# Altium project Lights Board.PrjPcb
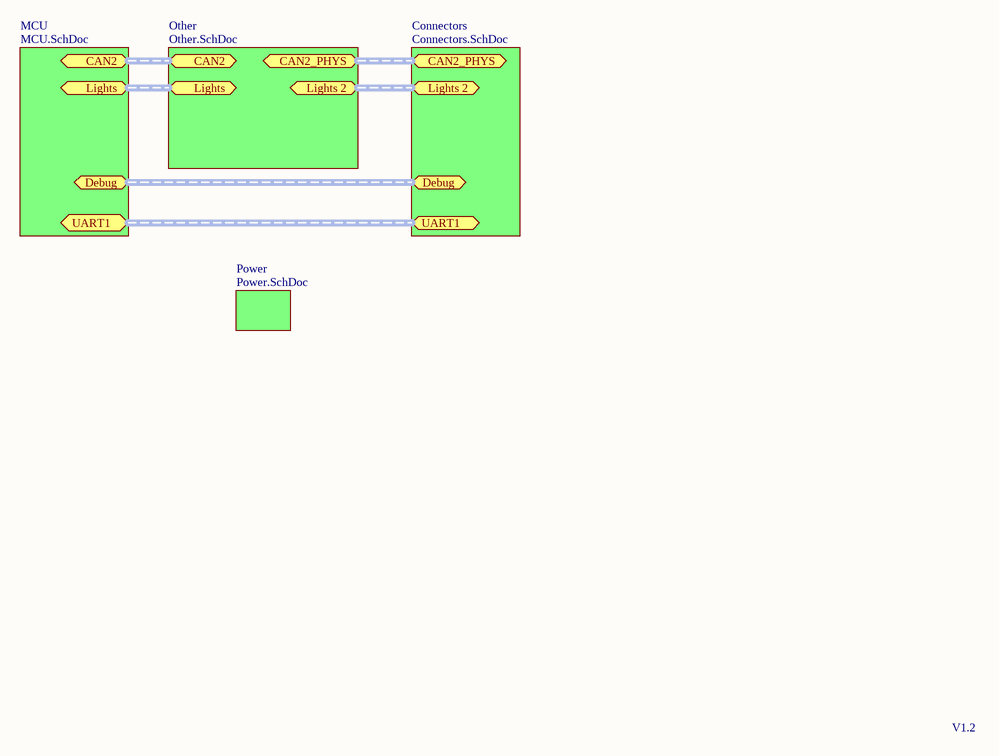
[diagram p0: Main.SchDoc]
5 sheets, 62 parts. Net scope: flat (ports and power ports of the same name join across sheets).
Board file: Main.PcbDoc
Sheets:
  Main.SchDoc
    MCU = MCU.SchDoc
    Connectors = Connectors.SchDoc
    Other = Other.SchDoc
    Power = Power.SchDoc

## Sheet Main.SchDoc
size A4

### Sub-sheets
Connectors = Connectors.SchDoc: no entries
MCU = MCU.SchDoc: no entries
Other = Other.SchDoc: no entries
Power = Power.SchDoc: no entries

### Ports
CAN2 (harness CAN), CAN2_PHYS (harness CAN_PHYS), Debug (harness Debug), Lights 2 (harness Light Control Signals), Lights (harness Light Control Signals), UART1 (harness UART)

### Notes on the sheet
- V1.2

## Sheet MCU.SchDoc
size A4
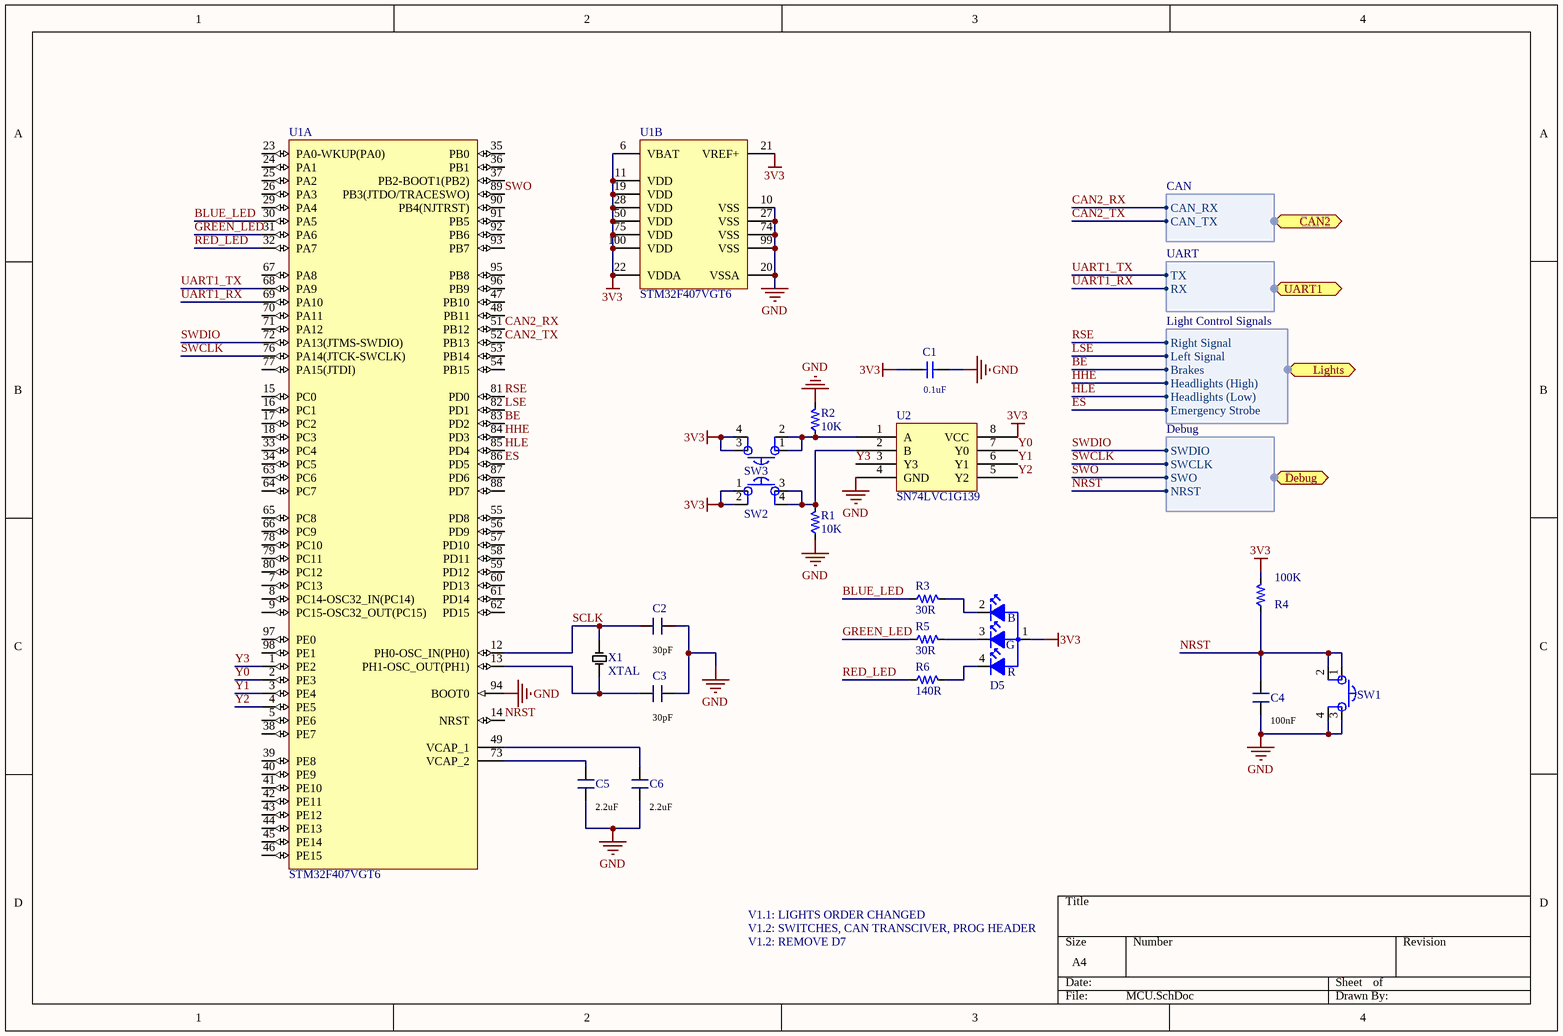
[diagram p1: MCU.SchDoc]

### Parts
C1  Capacitance: 0.1uF  [PCB_GENERIC_SMD_0603]  (hidden comment: SCH_GENERIC_CAPACITOR_0603)
C2  Capacitance: 30pF  [PCB_GENERIC_SMD_0603]  (hidden comment: SCH_GENERIC_CAPACITOR_0603)
C3  Capacitance: 30pF  [PCB_GENERIC_SMD_0603]  (hidden comment: SCH_GENERIC_CAPACITOR_0603)
C4  Capacitance: 100nF  [PCB_GENERIC_SMD_0603]  (hidden comment: SCH_GENERIC_CAPACITOR_0603)
C5  Capacitance: 2.2uF  [PCB_GENERIC_SMD_0603]  (hidden comment: SCH_GENERIC_CAPACITOR_0603)
C6  Capacitance: 2.2uF  [PCB_GENERIC_SMD_0603]  (hidden comment: SCH_GENERIC_CAPACITOR_0603)
D5  D0S4-000CR-00  [CLMVB-FKA]  (value not drawn)
R1  Resistance: 10K  [PCB_GENERIC_SMD_0603]  (hidden comment: SCH_GENERIC_RESISTOR_0603)
R2  Resistance: 10K  [PCB_GENERIC_SMD_0603]  (hidden comment: SCH_GENERIC_RESISTOR_0603)
R3  Resistance: 30R  [PCB_GENERIC_SMD_0603]  (hidden comment: SCH_GENERIC_RESISTOR_0603)
R4  Resistance: 100K  [PCB_GENERIC_SMD_0603]  (hidden comment: SCH_GENERIC_RESISTOR_0603)
R5  Resistance: 30R  [PCB_GENERIC_SMD_0603]  (hidden comment: SCH_GENERIC_RESISTOR_0603)
R6  Resistance: 140R  [PCB_GENERIC_SMD_0603]  (hidden comment: SCH_GENERIC_RESISTOR_0603)
SW1  Tactile Switch  [C&K 4 pin Tactile Switch]  (value not drawn)
SW2  Tactile Switch  [C&K 4 pin Tactile Switch]  (value not drawn)
SW3  Tactile Switch  [C&K 4 pin Tactile Switch]  (value not drawn)
U1  STM32F407VGT6  [STM-LQFP100_M]  (parts A,B of 2)
U2  SN74LVC1G139  [demux_24]
X1  XTAL  [CRYSTAL_8MHZ]

### Ports
CAN2 (harness CAN), Debug (harness Debug), Lights (harness Light Control Signals), UART1 (harness UART)

### Harnesses
Debug: SWDIO, SWCLK, SWO, NRST
CAN: CAN_RX, CAN_TX
UART: TX, RX
Light Control Signals: Right Signal, Left Signal, Brakes, Headlights (Low), Headlights (High), Emergency Strobe

### Nets
3V3: C1.1 D5.1(Red) R4.2 SW2.1 SW2.2 SW3.3 SW3.4 U1.6(VBAT) U1.11(VDD) U1.19(VDD) U1.21(VREF+) U1.22(VDDA) U1.28(VDD) U1.50(VDD) U1.75(VDD) U1.100(VDD) U2.8(VCC)
GND: C1.2 C2.1 C3.1 C4.2 C5.1 C6.1 R1.1 R2.2 SW1.3 SW1.4 U1.10(VSS) U1.20(VSSA) U1.27(VSS) U1.74(VSS) U1.94(BOOT0) U1.99(VSS) U2.4(GND)
BE: U1.83(PD2) ; port Lights.Brakes
BLUE_LED: R3.1 U1.30(PA5)
CAN2_RX: U1.51(PB12) ; port CAN2.CAN_RX
CAN2_TX: U1.52(PB13) ; port CAN2.CAN_TX
ES: U1.86(PD5) ; port Lights.Emergency Strobe
GREEN_LED: R5.1 U1.31(PA6)
HHE: U1.84(PD3) ; port Lights.Headlights (High)
HLE: U1.85(PD4) ; port Lights.Headlights (Low)
LSE: U1.82(PD1) ; port Lights.Left Signal
NRST: C4.1 R4.1 SW1.1 SW1.2 U1.14(NRST) ; port Debug.NRST
RED_LED: R6.1 U1.32(PA7)
RSE: U1.81(PD0) ; port Lights.Right Signal
SCLK: C2.2 U1.12(PH0-OSC_IN(PH0)) X1.1
SWCLK: U1.76(PA14(JTCK-SWCLK)) ; port Debug.SWCLK
SWDIO: U1.72(PA13(JTMS-SWDIO)) ; port Debug.SWDIO
SWO: U1.89(PB3(JTDO/TRACESWO)) ; port Debug.SWO
UART1_RX: U1.69(PA10) ; port UART1.RX
UART1_TX: U1.68(PA9) ; port UART1.TX
Y0: U1.2(PE3) U2.7(Y0)
Y1: U1.3(PE4) U2.6(Y1)
Y2: U1.4(PE5) U2.5(Y2)
Y3: U1.1(PE2) U2.3(Y3)
NetC3_2: C3.2 U1.13(PH1-OSC_OUT(PH1)) X1.2
NetC5_2: C5.2 U1.73(VCAP_2)
NetC6_2: C6.2 U1.49(VCAP_1)
NetD5_2: D5.2(Green) R3.2
NetD5_3: D5.3(Blue) R5.2
NetD5_4: D5.4 R6.2
NetR1_2: R1.2 SW2.3 SW2.4 U2.2(B)
NetR2_1: R2.1 SW3.1 SW3.2 U2.1(A)

Not connected (* = marked no-connect by the designer): U1 5(PE6) 7(PC13) 8(PC14-OSC32_IN(PC14)) 9(PC15-OSC32_OUT(PC15)) 15(PC0) 16(PC1) 17(PC2) 18(PC3) 23(PA0-WKUP(PA0)) 24(PA1) 25(PA2) 26(PA3) 29(PA4) 33(PC4) 34(PC5) 35(PB0) 36(PB1) 37(PB2-BOOT1(PB2)) 38(PE7) 39(PE8) 40(PE9) 41(PE10) 42(PE11) 43(PE12) 44(PE13) 45(PE14) 46(PE15) 47(PB10) 48(PB11) 53(PB14) 54(PB15) 55(PD8) 56(PD9) 57(PD10) 58(PD11) 59(PD12) 60(PD13) 61(PD14) 62(PD15) 63(PC6) 64(PC7) 65(PC8) 66(PC9) 67(PA8) 70(PA11) 71(PA12) 77(PA15(JTDI)) 78(PC10) 79(PC11) 80(PC12) 87(PD6) 88(PD7) 90(PB4(NJTRST)) 91(PB5) 92(PB6) 93(PB7) 95(PB8) 96(PB9) 97(PE0) 98(PE1)

### Notes on the sheet
- V1.1: LIGHTS ORDER CHANGED
- V1.2: SWITCHES, CAN TRANSCIVER, PROG HEADER
- V1.2: REMOVE D7
- (in symbol D0S4-000CR-00) B; G; R

### Library data of the parts
C1 = SCH_GENERIC_CAPACITOR_0603: Generic SMD capacitor 0603; Tolerance: *%; Voltage: *V
C2-C6 = SCH_GENERIC_CAPACITOR_0603: Generic SMD capacitor 0603; Tolerance: *%
D5 = D0S4-000CR-00: LED 4SMD RGB 2Vf 3Vf 3Vf 20mA 10mA 10mA; Supplier 1: Digi-Key; Supplier Part Number 1: CLMVB-FKA-CFHEHLCBB7A363CT-ND; Color: RGB
R1-R6 = SCH_GENERIC_RESISTOR_0603: Generic SMD resistor 0603
SW1-SW3 = C&K Tactile Switch: Supplier 1: Digi-Key; Supplier Part Number 1: CKN9085CT-ND
U1 = STM32F407VGT6: ARM Cortex-M4 32-bit MCU+FPU, 210 DMIPS, 1024 kB Flash, 192 kB Internal RAM, 82 I/Os, 100-pin LQFP, -40 to 85 degC, Tray; Manufacturer: STMicroelectronics; D/A Converter: 2x12-bit; FLASH Size (Prog) (kB): 1024; I/Os (High Current): 82; Internal RAM Size (kB): 192; Operating Frequency(F) (Processor speed) (MHz): 168; Supply Voltage(Vcc) max (V): 3.6; Supply Voltage(Vcc) min (V): 1.8; DatasheetVersion: Rev. 4; PackageVersion: Rev. 1, 06/2013; PackageReference: LQFP100; PackageDescription: 100-Pin Low Profile Quad Flat Package, 14 x 14 mm Body, 0.5 mm Pitch; Supplier 1: Digi-Key; Supplier Part Number 1: 497-11605-ND; Supplier 2: Farnell; Supplier Part Number 2: 2064368; Supplier 3: Newark; Supplier Part Number 3: 73T2333; Supplier 4: Mouser; Supplier Part Number 4: 511-STM32F407VGT6; Core: ARM Cortex-M4; Packing: Tray; Mounting Technology: Surface Mount; PartNumber: STM32F407VGT6; ComponentLink1Description: Manufacturer URL; ComponentLink1URL: http://www.st.com/web/en/home.html; ComponentLink2Description: Datasheet; ComponentLink2URL: http://www.st.com/st-web-ui/static/active/en/resource/technical/document/datasheet/DM00037051.pdf; ComponentLink3Description: Package Specification; ComponentLink3URL: http://www.st.com/st-web-ui/static/active/en/resource/technical/document/data_brief/DM00071938.pdf
U2 = demux_24
X1 = Crystal: Frequency: 8MHz

## Sheet Connectors.SchDoc
size A4
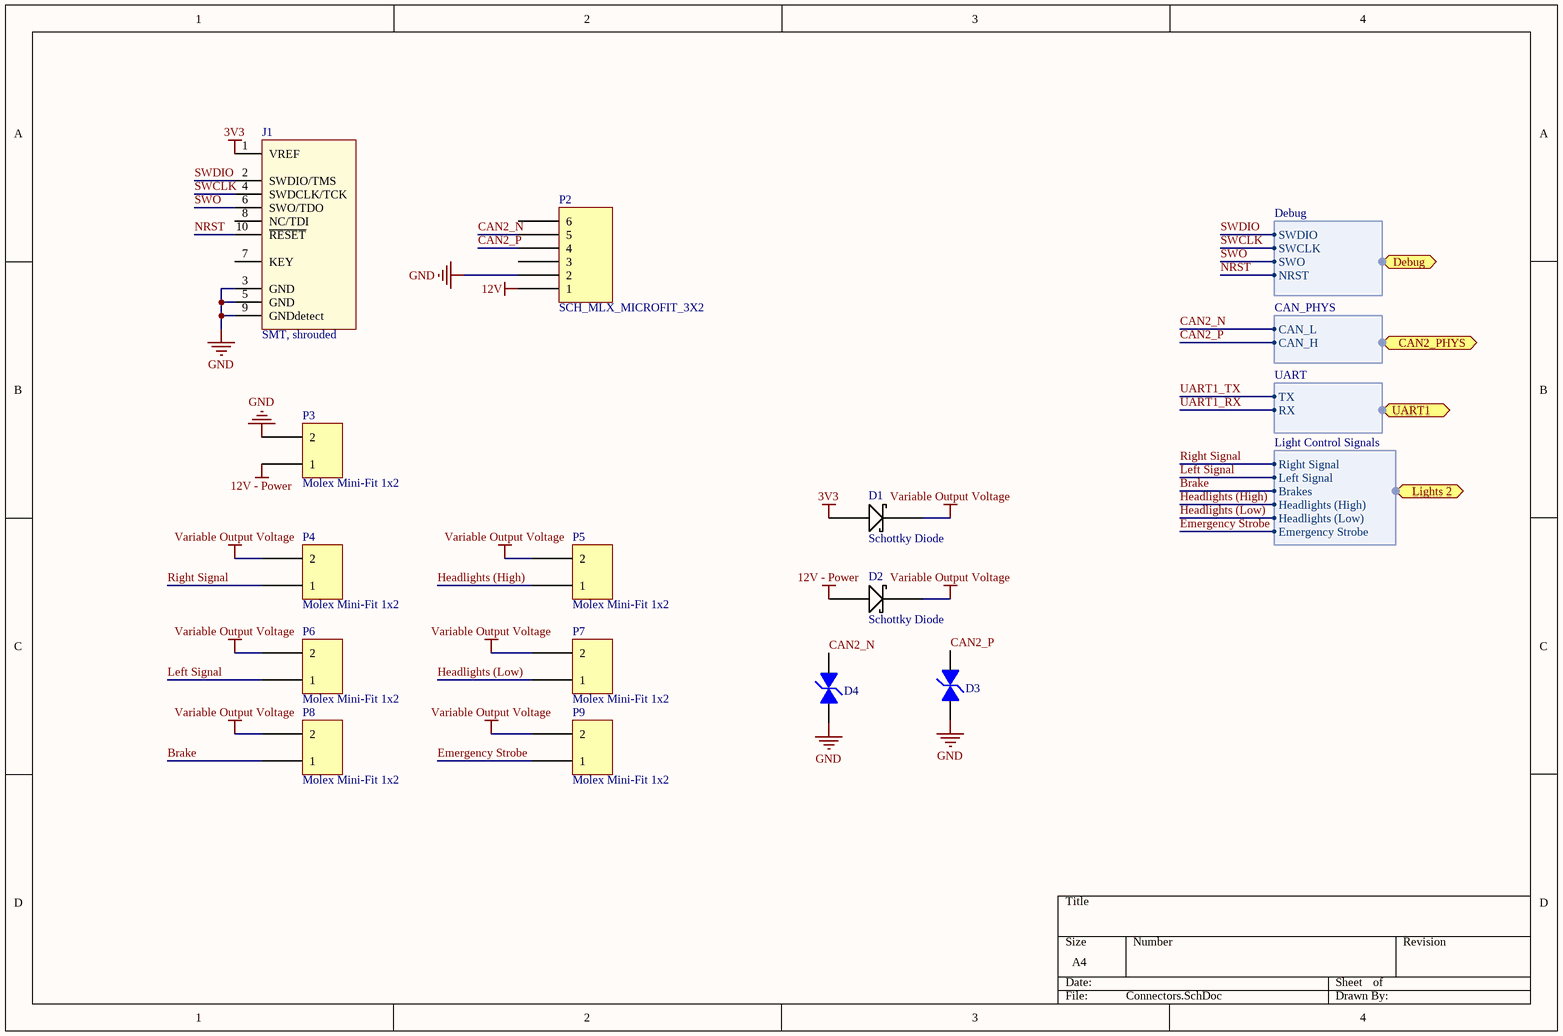
[diagram p2: Connectors.SchDoc]

### Parts
D1  Schottky Diode  [ON Semi Schottky Diode - MBRM110LT1G]
D2  Schottky Diode  [ON Semi Schottky Diode - MBRM110LT1G]
D3  TVS Diode  [TVS Diode]  (value not drawn)
D4  TVS Diode  [TVS Diode]  (value not drawn)
J1  SMT, shrouded  [CONN-50mil-10POS-SMD]
P2  SCH_MLX_MICROFIT_3X2  [PCB_MLX_MICROFIT_3X2]
P3  Molex Mini-Fit 1x2  [Molex Mini-Fit Jr 2x1]
P4  Molex Mini-Fit 1x2  [Molex Mini-Fit Jr 2x1]
P5  Molex Mini-Fit 1x2  [Molex Mini-Fit Jr 2x1]
P6  Molex Mini-Fit 1x2  [Molex Mini-Fit Jr 2x1]
P7  Molex Mini-Fit 1x2  [Molex Mini-Fit Jr 2x1]
P8  Molex Mini-Fit 1x2  [Molex Mini-Fit Jr 2x1]
P9  Molex Mini-Fit 1x2  [Molex Mini-Fit Jr 2x1]

### Ports
CAN2_PHYS (harness CAN_PHYS), Debug (harness Debug), Lights 2 (harness Light Control Signals), UART1 (harness UART)

### Harnesses
Debug: SWDIO, SWCLK, SWO, NRST
CAN_PHYS: CAN_L, CAN_H
UART: TX, RX
Light Control Signals: Right Signal, Left Signal, Brakes, Headlights (Low), Headlights (High), Emergency Strobe

### Nets
3V3: D1.2 J1.1(VREF)
12V: P2.1
12V - Power: D2.2 P3.1
GND: D3.2 D4.2 J1.3(GND) J1.5(GND) J1.9(GNDdetect) P2.2 P3.2
Variable Output Voltage: D1.1 D2.1 P4.2 P5.2 P6.2 P7.2 P8.2 P9.2
Brake: P8.1 ; port Lights 2.Brakes
CAN2_N: D4.1 P2.5 ; port CAN2_PHYS.CAN_L
CAN2_P: D3.1 P2.4 ; port CAN2_PHYS.CAN_H
Emergency Strobe: P9.1 ; port Lights 2.Emergency Strobe
Headlights (High): P5.1 ; port Lights 2.Headlights (High)
Headlights (Low): P7.1 ; port Lights 2.Headlights (Low)
Left Signal: P6.1 ; port Lights 2.Left Signal
NRST: J1.10(~{RESET}) ; port Debug.NRST
Right Signal: P4.1 ; port Lights 2.Right Signal
SWCLK: J1.4(SWDCLK/TCK) ; port Debug.SWCLK
SWDIO: J1.2(SWDIO/TMS) ; port Debug.SWDIO
SWO: J1.6(SWO/TDO) ; port Debug.SWO

Not connected (* = marked no-connect by the designer): J1 7(KEY) 8(NC/TDI); P2 3 6

### Library data of the parts
D1 D2 = ON Semi Schottky Diode - MBRM110LT1G
D3 D4 = TVS Diode: Manufacturer: Bourns; Manufacturer ID: CDSOD323-T03SC
J1 = conn_0.050"_cortexM: ARM Cortex-M 10pin connector,shrouded,SMT; Supplier 1: Digi-Key; Supplier Part Number 1: 1175-1629-ND

## Sheet Other.SchDoc
size A4
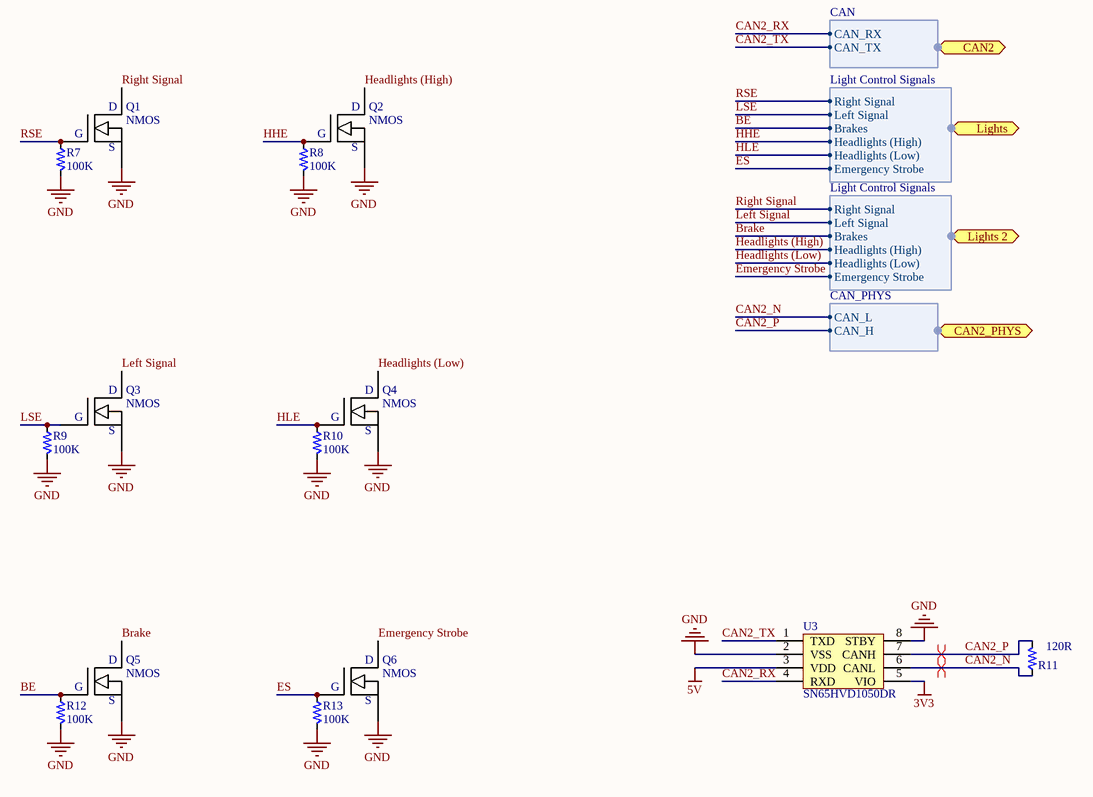
[diagram p3: Other.SchDoc]

### Parts
Q1  NMOS  [NMOS - SSM3K333R - SOTFL95P180X88-3M]
Q2  NMOS  [NMOS - SSM3K333R - SOTFL95P180X88-3M]
Q3  NMOS  [NMOS - SSM3K333R - SOTFL95P180X88-3M]
Q4  NMOS  [NMOS - SSM3K333R - SOTFL95P180X88-3M]
Q5  NMOS  [NMOS - SSM3K333R - SOTFL95P180X88-3M]
Q6  NMOS  [NMOS - SSM3K333R - SOTFL95P180X88-3M]
R7  Resistance: 100K  [PCB_GENERIC_SMD_0603]  (hidden comment: SCH_GENERIC_RESISTOR_0603)
R8  Resistance: 100K  [PCB_GENERIC_SMD_0603]  (hidden comment: SCH_GENERIC_RESISTOR_0603)
R9  Resistance: 100K  [PCB_GENERIC_SMD_0603]  (hidden comment: SCH_GENERIC_RESISTOR_0603)
R10  Resistance: 100K  [PCB_GENERIC_SMD_0603]  (hidden comment: SCH_GENERIC_RESISTOR_0603)
R11  Resistance: 120R  [PCB_GENERIC_SMD_0603]  (hidden comment: SCH_GENERIC_RESISTOR_0603)
R12  Resistance: 100K  [PCB_GENERIC_SMD_0603]  (hidden comment: SCH_GENERIC_RESISTOR_0603)
R13  Resistance: 100K  [PCB_GENERIC_SMD_0603]  (hidden comment: SCH_GENERIC_RESISTOR_0603)
U3  SN65HVD1050DR  [SOIC127P600X175-8N]

### Ports
CAN2 (harness CAN), CAN2_PHYS (harness CAN_PHYS), Lights 2 (harness Light Control Signals), Lights (harness Light Control Signals)

### Harnesses
CAN_PHYS: CAN_L, CAN_H
CAN: CAN_RX, CAN_TX
Light Control Signals: Right Signal, Left Signal, Brakes, Headlights (Low), Headlights (High), Emergency Strobe

### Nets
3V3: U3.5(VIO)
5V: U3.3(VDD)
GND: Q1.2(S) Q2.2(S) Q3.2(S) Q4.2(S) Q5.2(S) Q6.2(S) R7.2 R8.2 R9.2 R10.2 R12.2 R13.2 U3.2(VSS) U3.8(STBY)
BE: Q5.1(G) R12.1 ; port Lights.Brakes
Brake: Q5.3(D) ; port Lights 2.Brakes
CAN2_N: R11.1 U3.6(CANL) ; port CAN2_PHYS.CAN_L
CAN2_P: R11.2 U3.7(CANH) ; port CAN2_PHYS.CAN_H
CAN2_RX: U3.4(RXD) ; port CAN2.CAN_RX
CAN2_TX: U3.1(TXD) ; port CAN2.CAN_TX
Emergency Strobe: Q6.3(D) ; port Lights 2.Emergency Strobe
ES: Q6.1(G) R13.1 ; port Lights.Emergency Strobe
Headlights (High): Q2.3(D) ; port Lights 2.Headlights (High)
Headlights (Low): Q4.3(D) ; port Lights 2.Headlights (Low)
HHE: Q2.1(G) R8.1 ; port Lights.Headlights (High)
HLE: Q4.1(G) R10.1 ; port Lights.Headlights (Low)
Left Signal: Q3.3(D) ; port Lights 2.Left Signal
LSE: Q3.1(G) R9.1 ; port Lights.Left Signal
Right Signal: Q1.3(D) ; port Lights 2.Right Signal
RSE: Q1.1(G) R7.1 ; port Lights.Right Signal

### Layout directives
differential pair: CAN2_N, CAN2_P

### Library data of the parts
Q1-Q6 = NMOS - SSM3K333R
R7-R13 = SCH_GENERIC_RESISTOR_0603: Generic SMD resistor 0603
U3 = SN65HVD1050DR: IC EMC CAN TRANSCEIVER 8-SOIC; Supplier 1: Digi-Key; Supplier Part Number 1: 296-26335-1-ND

## Sheet Power.SchDoc
size A4
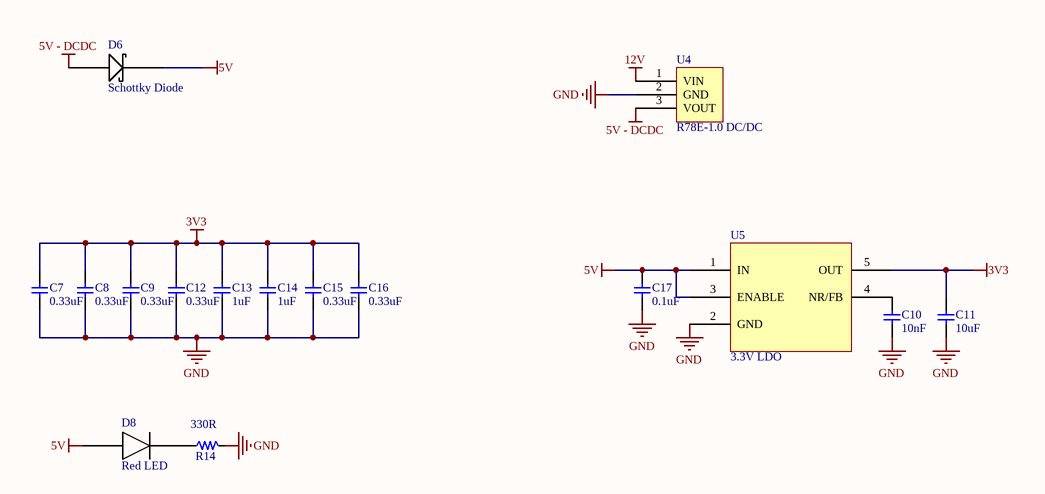
[diagram p4: Power.SchDoc]

### Parts
C7  value 0.33uF  [PCB_GENERIC_SMD_0603]  (hidden comment: C060-0001U-00)
C8  value 0.33uF  [PCB_GENERIC_SMD_0603]  (hidden comment: C060-0001U-00)
C9  value 0.33uF  [PCB_GENERIC_SMD_0603]  (hidden comment: C060-0001U-00)
C10  value 10nF  [PCB_GENERIC_SMD_0603]  (hidden comment: C060-0001U-00)
C11  value 10uF  [PCB_GENERIC_SMD_0603]  (hidden comment: C060-0001U-00)
C12  value 0.33uF  [PCB_GENERIC_SMD_0603]  (hidden comment: C060-0001U-00)
C13  value 1uF  [PCB_GENERIC_SMD_0603]  (hidden comment: C060-0001U-00)
C14  value 1uF  [PCB_GENERIC_SMD_0603]  (hidden comment: C060-0001U-00)
C15  value 0.33uF  [PCB_GENERIC_SMD_0603]  (hidden comment: C060-0001U-00)
C16  value 0.33uF  [PCB_GENERIC_SMD_0603]  (hidden comment: C060-0001U-00)
C17  value 0.1uF  [PCB_GENERIC_SMD_0603]  (hidden comment: C060-0001U-00)
D6  Schottky Diode  [ON Semi Schottky Diode - MBRM110LT1G]
D8  Red LED  [SMD_0603_LED]
R14  Resistance: 330R  [PCB_GENERIC_SMD_0603]  (hidden comment: SCH_GENERIC_RESISTOR_0603)
U4  R78E-1.0 DC/DC  [R78-1.0]
U5  3.3V LDO  [SOT95P280X145-5N]

### Nets
3V3: C7.2 C8.2 C9.2 C11.2 C12.2 C13.1 C14.1 C15.2 C16.2 U5.5(OUT)
5V: C17.2 D6.1 D8.1 U5.1(IN) U5.3(ENABLE)
5V - DCDC: D6.2 U4.3(VOUT)
12V: U4.1(VIN)
GND: C7.1 C8.1 C9.1 C10.1 C11.1 C12.1 C13.2 C14.2 C15.1 C16.1 C17.1 R14.2 U4.2(GND) U5.2(GND)
NetC10_2: C10.2 U5.4(NR/FB)
NetD8_2: D8.2 R14.1

### Library data of the parts
C7-C17 = C060-0001U-00: CAP CER 0603 1uF 16V X5R 20%; Tolerance: 20%; Voltage: 16V; Package: 0603
D6 = ON Semi Schottky Diode - MBRM110LT1G
D8 = SMD_0603_LED
R14 = SCH_GENERIC_RESISTOR_0603: Generic SMD resistor 0603
U4 = R78E-1.0
U5 = 3V3LDO_TPS73633DBVR_SOT23-5: Linear Voltage Regulator IC Positive Fixed 1 Output 3.3V 400mA SOT-23-5

## Nets that join several sheets
3V3: MCU (17 pins), Connectors (D1.2 J1.1), Other (U3.5), Power (10 pins)
5V: Other (U3.3), Power (5 pins)
12V: Connectors (P2.1), Power (U4.1)
GND: MCU (17 pins), Connectors (7 pins), Other (14 pins), Power (14 pins)
BE: MCU (U1.83), Other (Q5.1 R12.1)
Brake: Connectors (P8.1), Other (Q5.3)
CAN2_N: Connectors (D4.1 P2.5), Other (R11.1 U3.6)
CAN2_P: Connectors (D3.1 P2.4), Other (R11.2 U3.7)
CAN2_RX: MCU (U1.51), Other (U3.4)
CAN2_TX: MCU (U1.52), Other (U3.1)
Emergency Strobe: Connectors (P9.1), Other (Q6.3)
ES: MCU (U1.86), Other (Q6.1 R13.1)
Headlights (High): Connectors (P5.1), Other (Q2.3)
Headlights (Low): Connectors (P7.1), Other (Q4.3)
HHE: MCU (U1.84), Other (Q2.1 R8.1)
HLE: MCU (U1.85), Other (Q4.1 R10.1)
Left Signal: Connectors (P6.1), Other (Q3.3)
LSE: MCU (U1.82), Other (Q3.1 R9.1)
NRST: MCU (5 pins), Connectors (J1.10)
Right Signal: Connectors (P4.1), Other (Q1.3)
RSE: MCU (U1.81), Other (Q1.1 R7.1)
SWCLK: MCU (U1.76), Connectors (J1.4)
SWDIO: MCU (U1.72), Connectors (J1.2)
SWO: MCU (U1.89), Connectors (J1.6)